# Altium schematic sheet Power.SchDoc: =documentname
size 279 x 215 mm; CheckedBy: TBD; Engineer: Yuchen Lin; Organization: UW Robotics; Address1: 200 University Avenue; Address2: Waterloo; Address3: Ontario; Address4: Canada N2L 3G6; DocumentNumber: 1; Revision: 1.0; SheetNumber: 1; SheetTotal: 2; designer: Yuchen Lin; reviewer: TBD; total sheets: 2; version: 1.0
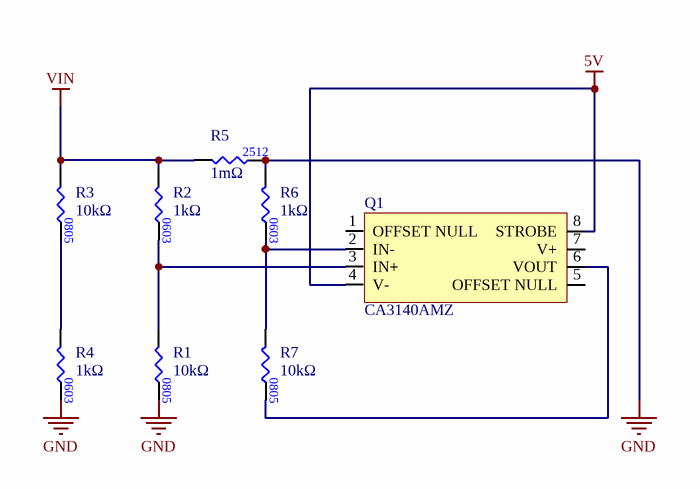
[diagram p0: Power.SchDoc]

## Parts
Q1  OPAMP_CA3140AMZ  [CA3140AMZ]  (value not drawn)
R1  value 10kΩ  [RES0805]  (hidden comment: RES_10kΩ_0805_5%)
R2  value 1kΩ  [RES0603]  (hidden comment: RES_1kΩ_0603_5%)
R3  value 10kΩ  [RES0805]  (hidden comment: RES_10kΩ_0805_5%)
R4  value 1kΩ  [RES0603]  (hidden comment: RES_1kΩ_0603_5%)
R5  value 1mΩ  [RESC6532X75N]  (hidden comment: RES_1mΩ_2512_1%)
R6  value 1kΩ  [RES0603]  (hidden comment: RES_1kΩ_0603_5%)
R7  value 10kΩ  [RES0805]  (hidden comment: RES_10kΩ_0805_5%)

## Nets
5V: Q1.4(V-) Q1.8(STROBE)
GND: R1.2 R4.2 R5.2 R6.1
VIN: R2.1 R3.1 R5.1
NetQ1_2: Q1.2(IN-) R6.2 R7.1
NetQ1_3: Q1.3(IN+) R1.1 R2.2
NetQ1_6: Q1.6(VOUT) R7.2
NetR3_2: R3.2 R4.1

Not connected (* = marked no-connect by the designer): Q1 1(OFFSET_NULL) 5(OFFSET_NULL) 7(V+)

## Notes on the sheet
- University of Waterloo Robotics Team
- 200 University Ave W
- REV
- PROJECT
- Waterloo, Ontario, Canada
- N2L 3G1
- DOCUMENT
- ENGINEER
- REVIEWER
- MODIFIED
- SHEET
- OF

## Library data of the parts
Q1 = OPAMP_CA3140AMZ: IC OPAMP GP 1 CIRCUIT 8SOIC; Manufacturer 1: Renesas Electronics America Inc.; Supplier Part Number 1: CA3140AMZ-ND; Supplier 1: Digi-Key; Manufacturer Part Number 1: CA3140AMZ
R1 R3 R7 = RES_10kΩ_0805_5%: RES 10K OHM 5% 1/8W 0805; Manufacturer 1: Panasonic Electronic Components; Manufacturer Part Number 1: ERJ-6GEYJ103V; Package/Footprint: 0805; Supplier 1: Digi-Key; Supplier Part Number 1: P10KACT-ND; LCSC Part #: C17414; Mounting Type: SMD
R2 R4 R6 = RES_1kΩ_0603_5%: RES 1K OHM 5% 1/10W 0603; Manufacturer 1: Yageo; Manufacturer Part Number 1: RC0603JR-071KL; Supplier Part Number 1: 311-1.0KGRCT-ND; Supplier 1: Digi-Key; Mounting Type: SMD; Package: 0603
R5 = RES_1mΩ_2512_1%: RES 1 mOHM 1% 3W 2512; Manufacturer 1: Riedon; Manufacturer Part Number 1: CSRL3-0R001F8; Supplier 1: Digi-Key; Supplier Part Number 1: 696-1834-1-ND; Mounting Type: SMD; Package: 2512